# Altium project OSCILLAR_HFB_V1p0.PrjPcb
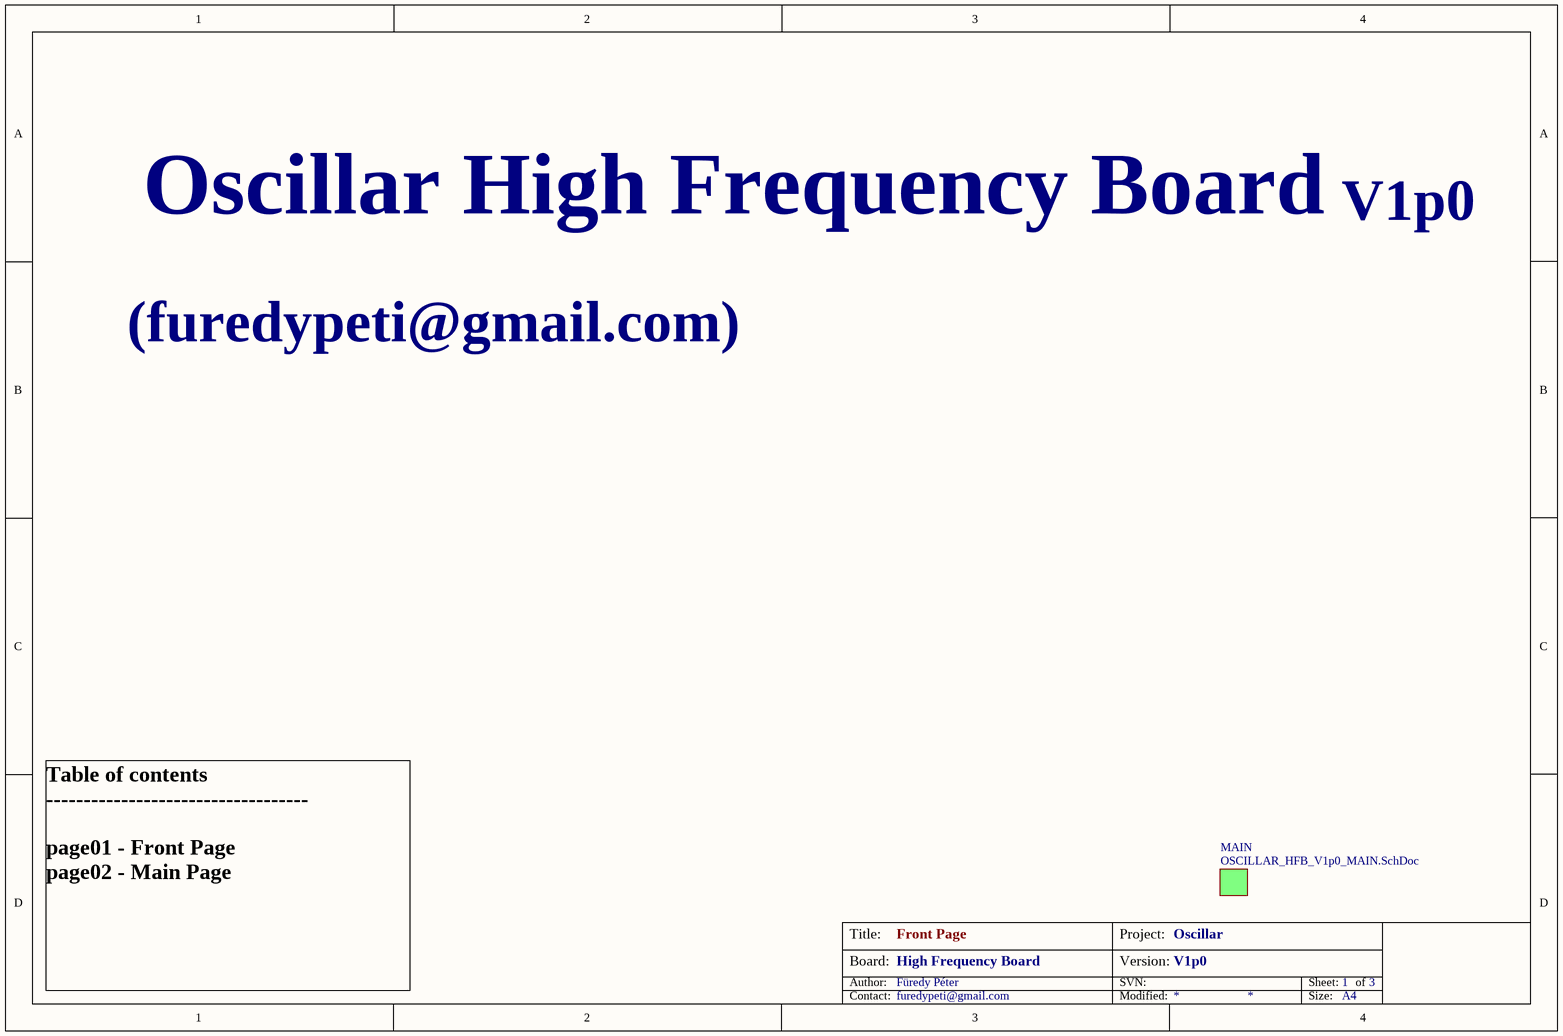
[diagram p0: OSCILLAR_HFB_V1p0_FRP.SchDoc]
GAuthor: Füredy Péter; GBoardName: High Frequency Board; GContact: furedypeti@gmail.com; GProjectName: Oscillar; GVersion: V1p0
13 sheets, 162 parts. Net scope: flat (ports and power ports of the same name join across sheets).
Board file: OSCILLAR_HFB_V1p0.PcbDoc
Sheets:
  OSCILLAR_HFB_V1p0_FRP.SchDoc
    MAIN = OSCILLAR_HFB_V1p0_MAIN.SchDoc
      MAIN SYNTH = OSCILLAR_HFB_V1p0_MSYN.SchDoc
      CAL = OSCILLAR_HFB_V1p0_CAL.SchDoc
      LVL = OSCILLAR_HFB_V1p0_LVL.SchDoc
      MECH = OSCILLAR_HFB_V1p0_MECH.SchDoc
      HFPS = OSCILLAR_HFB_V1p0_HFPS.SchDoc
      HFPS = OSCILLAR_HFB_V1p0_HFPS.SchDoc
      HFLNAMP = OSCILLAR_HFB_V1p0_HFLNAMP.SchDoc
      LFLNAMP = OSCILLAR_HFB_V1p0_LFLNAMP.SchDoc
      HFFILTB = OSCILLAR_HFB_V1p0_HFFILTB.SchDoc
      LFFILTB = OSCILLAR_HFB_V1p0_LFFILTB.SchDoc
      DRV = OSCILLAR_HFB_V1p0_DRV.SchDoc
  OSCILLAR_HFB_V1p0_INT.SchDoc

## Sheet OSCILLAR_HFB_V1p0_FRP.SchDoc
size A4; DocumentNumber: 1; SheetNumber: 1; SheetTotal: 3; Title_: Front Page

### Sub-sheets
MAIN = OSCILLAR_HFB_V1p0_MAIN.SchDoc: no entries

### Notes on the sheet
- (furedypeti@gmail.com)
- Table of contents
  -----------------------------------
  page01 - Front Page
  page02 - Main Page
- Board:
- Author:
- Title:
- Project:
- SVN:
- Version:
- Sheet:
- of
- Contact:
- Modified:
- Size:
- A4

## Sheet OSCILLAR_HFB_V1p0_MAIN.SchDoc
size A4; SheetNumber: 2; SheetTotal: 13; Title_: Main Page
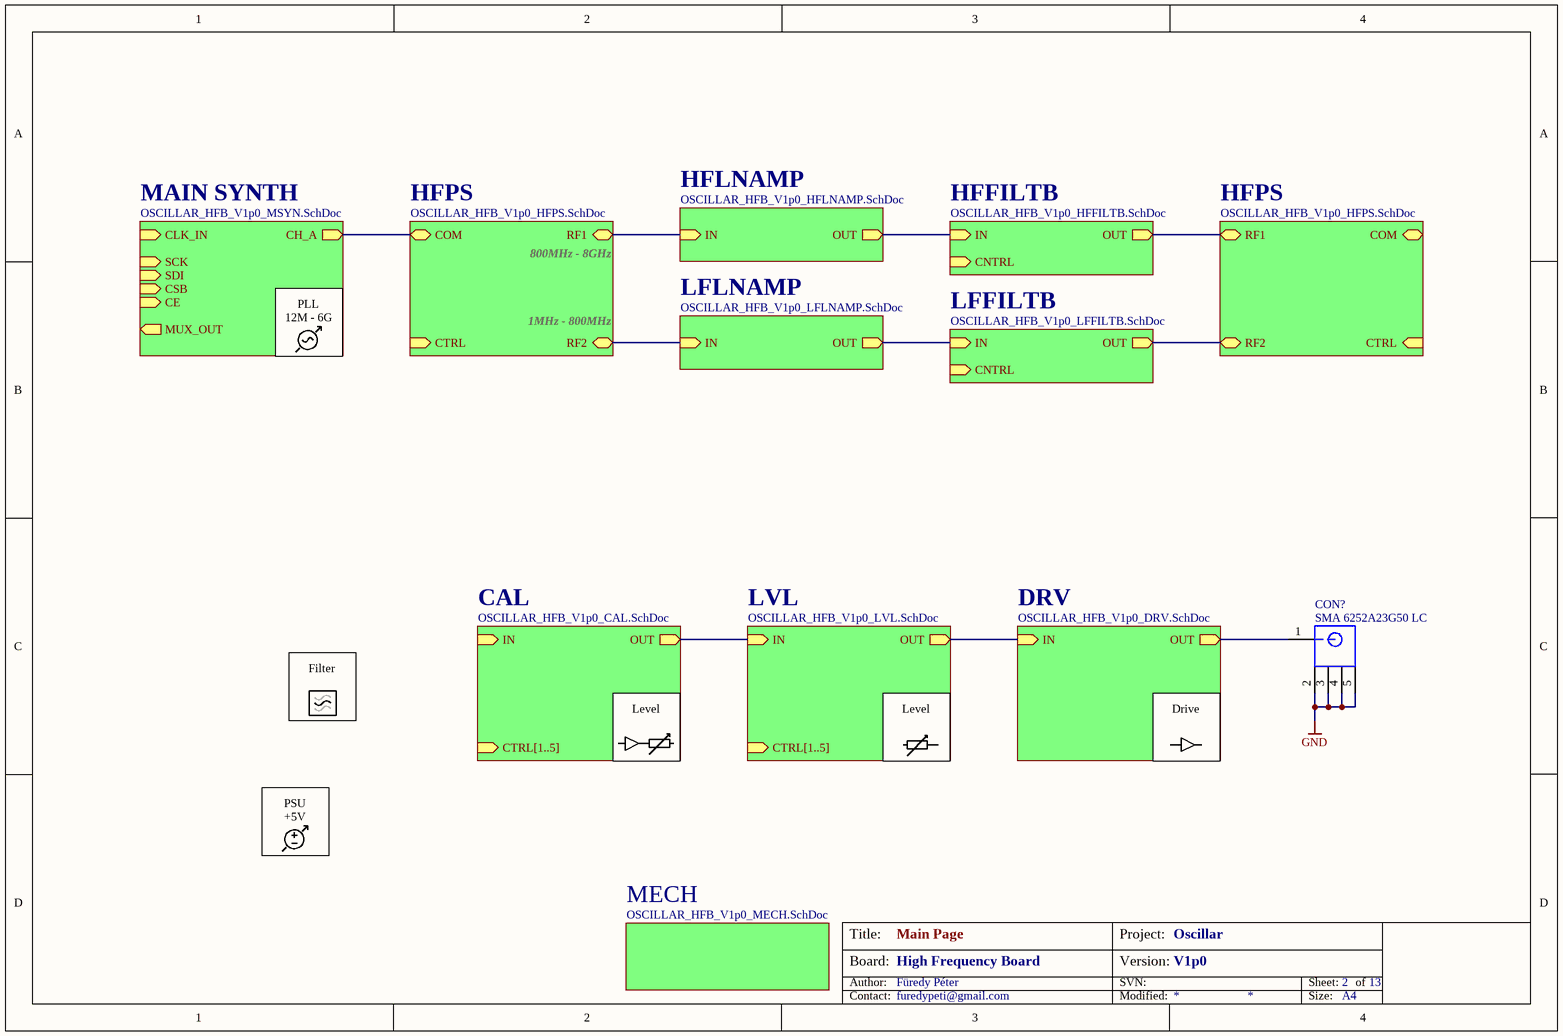
[diagram p1: OSCILLAR_HFB_V1p0_MAIN.SchDoc]

### Parts
(Parts that share a designator on the sheet are numbered #1, #2 ... from top to bottom, then left to right.)
CON?#1  SMA 6252A23G50 LC  [SMA-90]

### Sub-sheets
CAL = OSCILLAR_HFB_V1p0_CAL.SchDoc: IN (in), OUT (out), CTRL[1..5] (in)
DRV = OSCILLAR_HFB_V1p0_DRV.SchDoc: IN (in), OUT (out)
HFFILTB = OSCILLAR_HFB_V1p0_HFFILTB.SchDoc: IN (in), OUT (out), CNTRL (in)
HFLNAMP = OSCILLAR_HFB_V1p0_HFLNAMP.SchDoc: OUT (out), IN (in)
HFPS = OSCILLAR_HFB_V1p0_HFPS.SchDoc: COM (bidir), RF1 (bidir), CTRL (in), RF2 (bidir)
HFPS = OSCILLAR_HFB_V1p0_HFPS.SchDoc: RF1 (bidir), COM (bidir), CTRL (in), RF2 (bidir)
LFFILTB = OSCILLAR_HFB_V1p0_LFFILTB.SchDoc: IN (in), OUT (out), CNTRL (in)
LFLNAMP = OSCILLAR_HFB_V1p0_LFLNAMP.SchDoc: IN (in), OUT (out)
LVL = OSCILLAR_HFB_V1p0_LVL.SchDoc: IN (in), OUT (out), CTRL[1..5] (in)
MAIN SYNTH = OSCILLAR_HFB_V1p0_MSYN.SchDoc: CLK_IN (in), SCK (in), SDI (in), CSB (in), CE (in), MUX_OUT (out), CH_A (out)
MECH = OSCILLAR_HFB_V1p0_MECH.SchDoc: no entries

### Nets
GND: CON?#1.2 CON?#1.3 CON?#1.4 CON?#1.5
NetCON?#1_1: CON?#1.1 ; sheet DRV/OUT
(unnamed): sheet MAIN SYNTH/CH_A, sheet HFPS/COM
(unnamed): sheet CAL/OUT, sheet LVL/IN
(unnamed): sheet LVL/OUT, sheet DRV/IN
(unnamed): sheet HFPS/RF1, sheet HFLNAMP/IN
(unnamed): sheet HFPS/RF2, sheet LFLNAMP/IN
(unnamed): sheet HFPS/RF1, sheet HFFILTB/OUT
(unnamed): sheet HFPS/RF2, sheet LFFILTB/OUT
(unnamed): sheet HFLNAMP/OUT, sheet HFFILTB/IN
(unnamed): sheet LFLNAMP/OUT, sheet LFFILTB/IN

### Notes on the sheet
- 800MHz - 8GHz
- PLL
  12M - 6G
- 1MHz - 800MHz
- Filter
- Level
- Drive
- PSU
  +5V
- Board:
- Author:
- Title:
- Project:
- SVN:
- Version:
- Sheet:
- of
- Contact:
- Modified:
- Size:
- A4

### Library data of the parts
CON?#1 = SMA 6252A23G50 LC: SMA female, 90°; Part number: 100.310.40; Type: CON; Supplier: Hestore; ComponentLink1Description: Datasheet; ComponentLink2Description: Order; ComponentLink2URL: https://www.hestore.hu/prod_10031040.html

## Sheet OSCILLAR_HFB_V1p0_MSYN.SchDoc
size A4; SheetNumber: 3; SheetTotal: 11
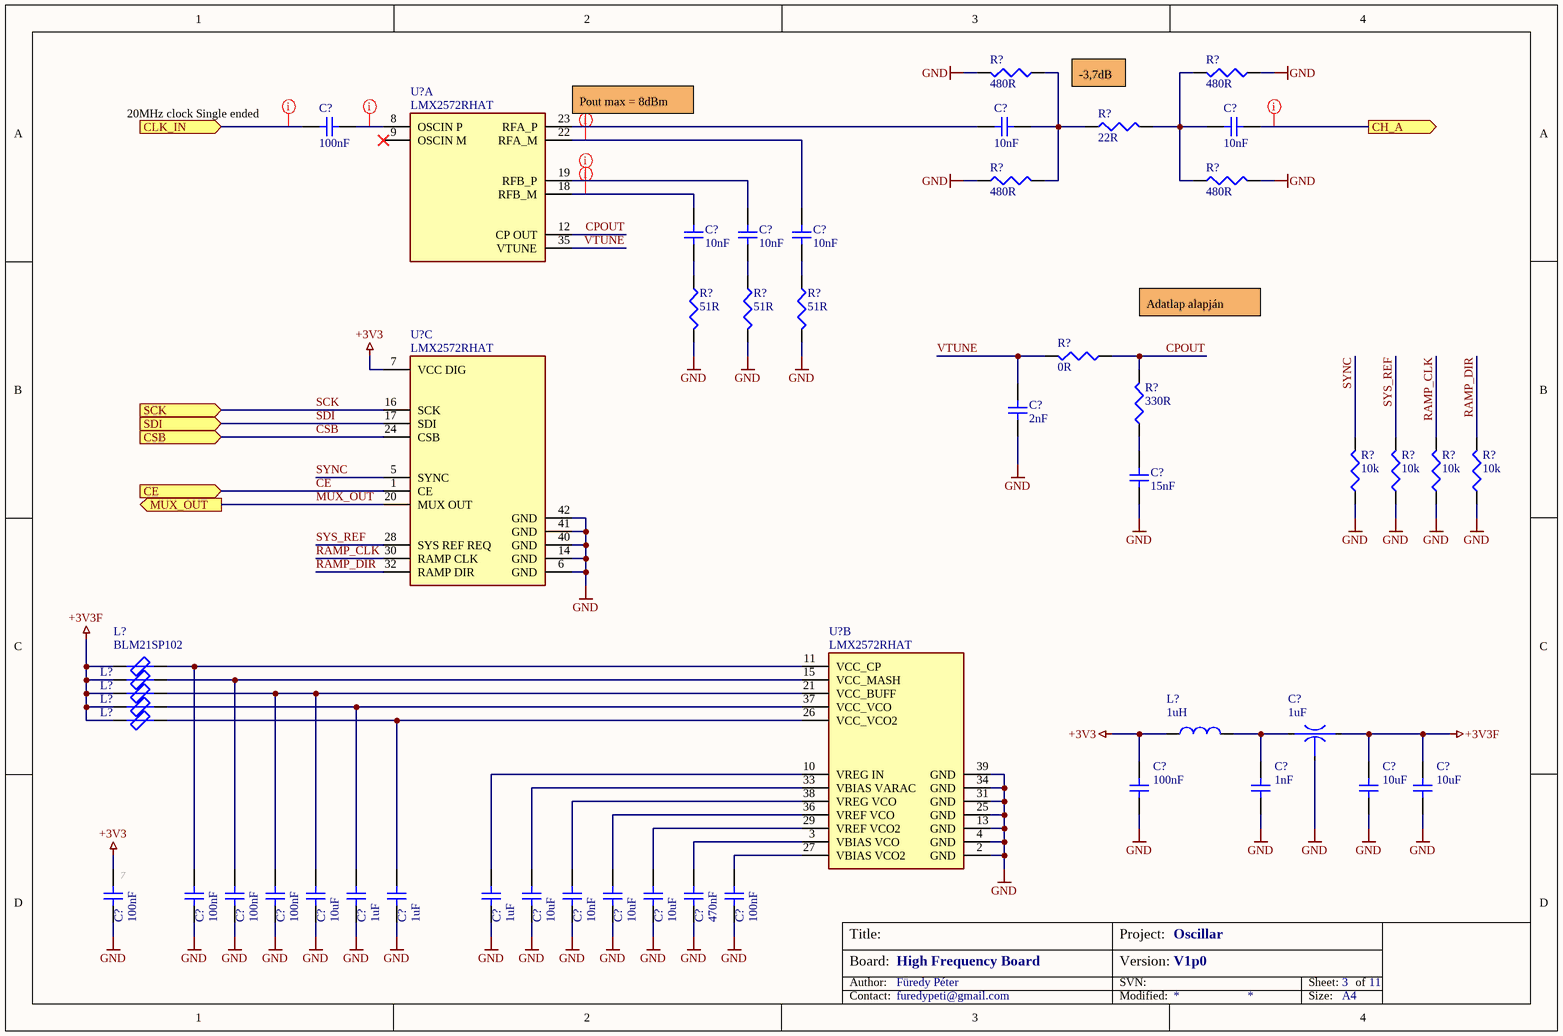
[diagram p2: OSCILLAR_HFB_V1p0_MSYN.SchDoc]

### Parts
(Parts that share a designator on the sheet are numbered #1, #2 ... from top to bottom, then left to right.)
C?#1  100nF  [CAP_0603]
C?#2  10nF  [CAP_0603]
C?#3  10nF  [CAP_0603]
C?#4  10nF  [CAP_0603]
C?#5  10nF  [CAP_0603]
C?#6  10nF  [CAP_0603]
C?#7  2nF  [CAP_0603]
C?#8  15nF  [CAP_0603]
C?#9  1uF  [CAP-0805-EMI]
C?#10  100nF  [CAP-0805]
C?#11  1nF  [CAP-0805]
C?#12  10uF  [CAP_0603]
C?#13  10uF  [CAP_0603]
C?#14  100nF  [CAP_0603]
C?#15  100nF  [CAP_0603]
C?#16  100nF  [CAP_0603]
C?#17  100nF  [CAP_0603]
C?#18  10uF  [CAP_0603]
C?#19  1uF  [CAP_0603]
C?#20  1uF  [CAP_0603]
C?#21  1uF  [CAP_0603]
C?#22  10uF  [CAP_0603]
C?#23  10nF  [CAP_0603]
C?#24  10uF  [CAP_0603]
C?#25  10uF  [CAP_0603]
C?#26  470nF  [CAP_0603]
C?#27  100nF  [CAP_0603]
L?#1  BLM21SP102  [IND-0805-EMI]
L?#2  1000R  [IND-0805-EMI]  (value not drawn)
L?#3  1000R  [IND-0805-EMI]  (value not drawn)
L?#4  1000R  [IND-0805-EMI]  (value not drawn)
L?#5  1000R  [IND-0805-EMI]  (value not drawn)
L?#6  1uH  [IND-0805]
R?#1  480R  [RES-0603]
R?#2  480R  [RES-0603]
R?#3  22R  [RES-0603]
R?#4  480R  [RES-0603]
R?#5  480R  [RES-0603]
R?#6  51R  [RES-0603]
R?#7  51R  [RES-0603]
R?#8  51R  [RES-0603]
R?#9  0R  [RES-0603]
R?#10  330R  [RES-0603]
R?#11  10k  [RES-0603]
R?#12  10k  [RES-0603]
R?#13  10k  [RES-0603]
R?#14  10k  [RES-0603]
U?#1  LMX2572RHAT  [VQFN40]  (part A of 3)
U?#2  LMX2572RHAT  [VQFN40]  (part C of 3)
U?#3  LMX2572RHAT  [VQFN40]  (part B of 3)

### Ports
CE (in, see OSCILLAR_HFB_V1p0_MAIN), CH_A (out, see OSCILLAR_HFB_V1p0_MAIN), CLK_IN (in, see OSCILLAR_HFB_V1p0_MAIN), CSB (in, see OSCILLAR_HFB_V1p0_MAIN), MUX_OUT (out, see OSCILLAR_HFB_V1p0_MAIN), SCK (in, see OSCILLAR_HFB_V1p0_MAIN), SDI (in, see OSCILLAR_HFB_V1p0_MAIN)

### Nets
+3V3: C?#10.1 C?#14.2 L?#6.1 U?#2.7(VCC_DIG)
+3V3F: C?#9.1 C?#12.1 C?#13.1 L?#1.1 L?#2.1 L?#3.1 L?#4.1 L?#5.1
GND: C?#7.2 C?#8.1 C?#9.2 C?#10.2 C?#11.2 C?#12.2 C?#13.2 C?#14.1 C?#15.1 C?#16.1 C?#17.1 C?#18.2 C?#19.1 C?#20.1 C?#21.2 C?#22.2 C?#23.2 C?#24.2 C?#25.2 C?#26.2 C?#27.2 R?#1.2 R?#2.2 R?#4.1 R?#5.1 R?#6.2 R?#7.2 R?#8.2 R?#11.1 R?#12.1 R?#13.1 R?#14.1 U?#2.6(GND) U?#2.14(GND) U?#2.40(GND) U?#2.41(GND) U?#2.42(GND) U?#3.2(GND) U?#3.4(GND) U?#3.13(GND) U?#3.25(GND) U?#3.31(GND) U?#3.34(GND) U?#3.39(GND)
CE: U?#2.1(CE) ; port CE
CPOUT: R?#9.1 R?#10.2 U?#1.12(CP_OUT)
CSB: U?#2.24(CSB) ; port CSB
MUX_OUT: U?#2.20(MUX_OUT) ; port MUX_OUT
RAMP_CLK: R?#13.2 U?#2.30(RAMP_CLK)
RAMP_DIR: R?#14.2 U?#2.32(RAMP_DIR)
SCK: U?#2.16(SCK) ; port SCK
SDI: U?#2.17(SDI) ; port SDI
SYNC: R?#11.2 U?#2.5(SYNC)
SYS_REF: R?#12.2 U?#2.28(SYS_REF_REQ)
VTUNE: C?#7.1 R?#9.2 U?#1.35(VTUNE)
NetC?#1_1: C?#1.1 U?#1.8(OSCIN_P)
NetC?#1_2: C?#1.2 ; port CLK_IN
NetC?#2_1: C?#2.1 R?#1.1 R?#3.2 R?#4.2
NetC?#2_2: C?#2.2 U?#1.23(RFA_P)
NetC?#3_1: C?#3.1 R?#2.1 R?#3.1 R?#5.2
NetC?#3_2: C?#3.2 ; port CH_A
NetC?#4_1: C?#4.1 U?#1.18(RFB_M)
NetC?#4_2: C?#4.2 R?#6.1
NetC?#5_1: C?#5.1 U?#1.19(RFB_P)
NetC?#5_2: C?#5.2 R?#7.1
NetC?#6_1: C?#6.1 U?#1.22(RFA_M)
NetC?#6_2: C?#6.2 R?#8.1
NetC?#8_2: C?#8.2 R?#10.1
NetC?#9_3: C?#9.3 C?#11.1 L?#6.2
NetC?#15_2: C?#15.2 L?#1.2 U?#3.11(VCC_CP)
NetC?#16_2: C?#16.2 L?#2.2 U?#3.15(VCC_MASH)
NetC?#17_2: C?#17.2 C?#18.1 L?#3.2 U?#3.21(VCC_BUFF)
NetC?#19_2: C?#19.2 L?#4.2 U?#3.37(VCC_VCO)
NetC?#20_2: C?#20.2 L?#5.2 U?#3.26(VCC_VCO2)
NetC?#21_1: C?#21.1 U?#3.10(VREG_IN)
NetC?#22_1: C?#22.1 U?#3.33(VBIAS_VARAC)
NetC?#23_1: C?#23.1 U?#3.38(VREG_VCO)
NetC?#24_1: C?#24.1 U?#3.36(VREF_VCO)
NetC?#25_1: C?#25.1 U?#3.29(VREF_VCO2)
NetC?#26_1: C?#26.1 U?#3.3(VBIAS_VCO)
NetC?#27_1: C?#27.1 U?#3.27(VBIAS_VCO2)

Not connected (* = marked no-connect by the designer): U?#1 9(OSCIN_M)*

### Layout directives
net class 50R: NetC?#1_1, NetC?#1_2, NetC?#2_2, NetC?#3_2, NetC?#4_1, NetC?#5_1, NetC?#6_1

### Notes on the sheet
- (near C?#1) 20MHz clock Single ended
- (near U?#1) Pout max = 8dBm
- (near R?#1) -3,7dB
- Adatlap alapján
- (near C?#14) 7
- Board:
- Author:
- Title:
- Project:
- SVN:
- Version:
- Sheet:
- of
- Contact:
- Modified:
- Size:
- A4

### Library data of the parts
C?#1-C?#8 C?#10-C?#27 = NP-CAPACITOR: MLCC capacitor; Type: CAP
C?#9 = EMI_CAPACITOR: EMI filter capacitor; Type: CAP
L?#1-L?#5 = BLM21SP102SN1D: Chip Ferrite Bead, 1000R @100MHz, 1.6A; Part number: 81-BLM21SP102SN1D; Type: IND; Supplier: Mouser; ComponentLink1Description: Datasheet; ComponentLink1URL: ENFA0005-1915781.pdf; ComponentLink2Description: Order; ComponentLink2URL: https://hu.mouser.com/ProductDetail/Murata-Electronics/BLM21SP102SN1D?qs=17u8i%2FzlE88oj6hmj%252BXptA%3D%3D
L?#6 = AC-INDUCTOR: Air core coil; Type: IND
R?#1-R?#14 = RESISTOR: Metal Film Resistor; Type: RES
U?#1-U?#3 = LMX2572RHAT: Phase Locked Loop, PLL 6.4-GHz, low power, wideband RF synthesizer with FSK modulation; Part number: 595-LMX2572RHAT; Supplier: Mouser; Type: IC; ComponentLink1Description: Datasheet; ComponentLink1URL: lmx2572lp.pdf; ComponentLink2Description: Order; ComponentLink2URL: https://hu.mouser.com/ProductDetail/Texas-Instruments/LMX2572RHAT?qs=BZBei1rCqCAcV8D5kfnwXg%3D%3D

## Sheet OSCILLAR_HFB_V1p0_CAL.SchDoc
size A4; SheetNumber: 9; SheetTotal: 11; Title_: Aux Gain Stabilization Block
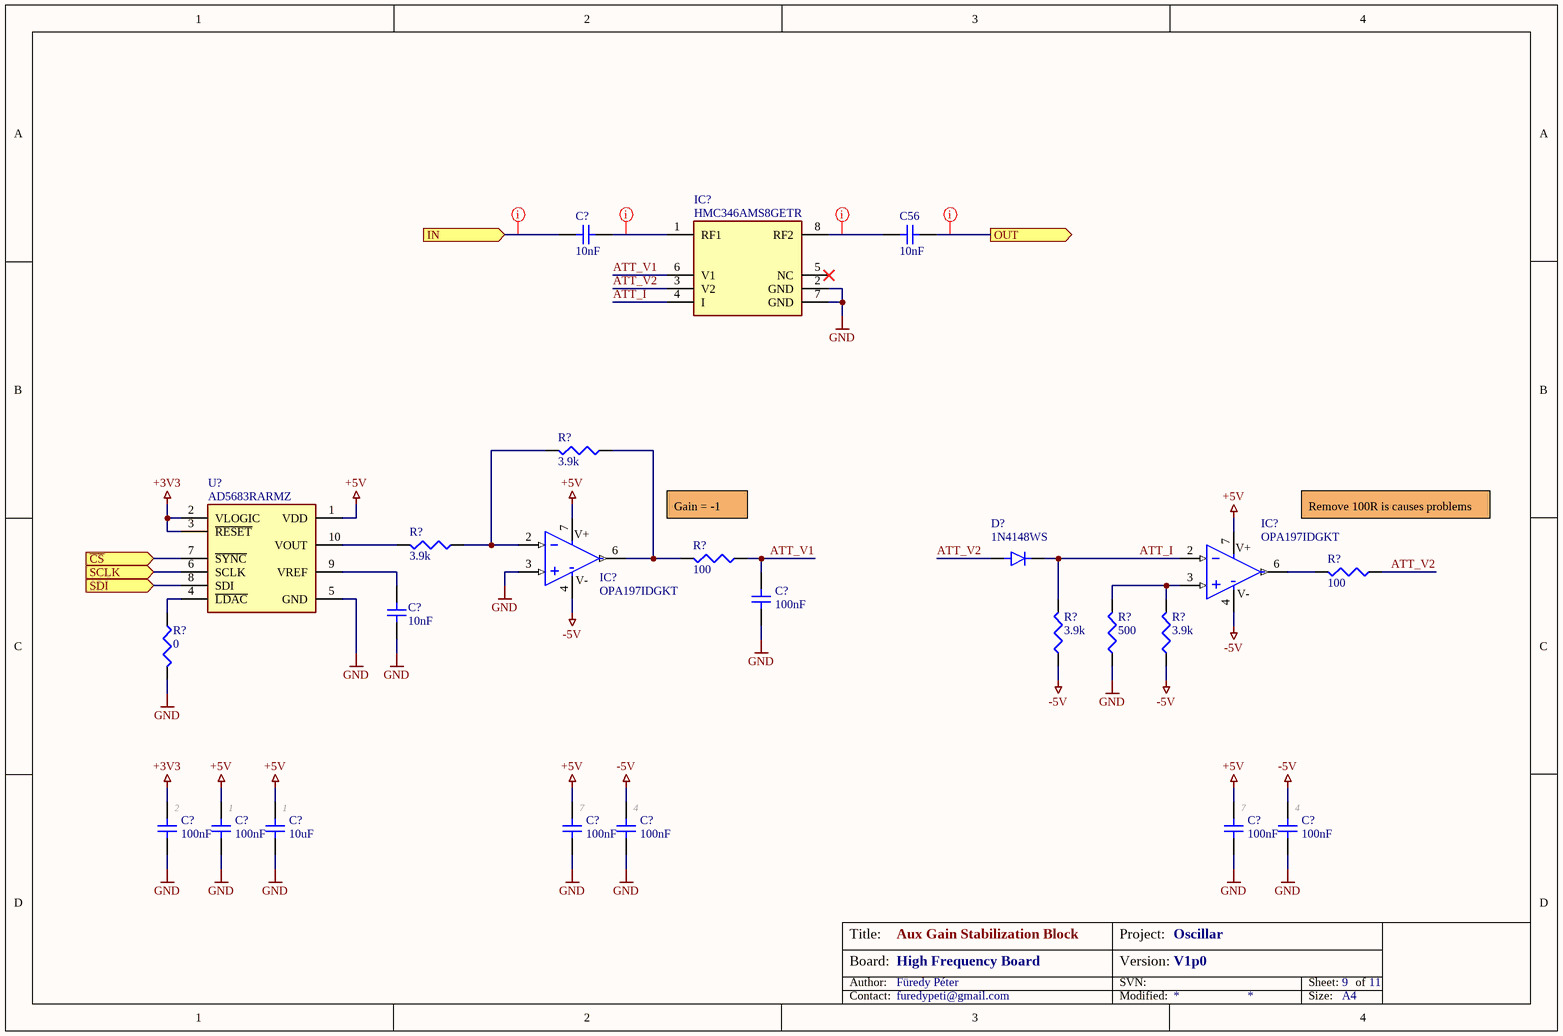
[diagram p3: OSCILLAR_HFB_V1p0_CAL.SchDoc]

### Parts
(Parts that share a designator on the sheet are numbered #1, #2 ... from top to bottom, then left to right.)
C56#1  10nF  [CAP_0603]
C?#28  10nF  [CAP_0603]
C?#29  100nF  [CAP-0805]
C?#30  10nF  [CAP_0603]
C?#31  100nF  [CAP-0805]
C?#32  100nF  [CAP-0805]
C?#33  10uF  [CAP_0603]
C?#34  100nF  [CAP-0805]
C?#35  100nF  [CAP-0805]
C?#36  100nF  [CAP-0805]
C?#37  100nF  [CAP-0805]
D?  1N4148WS  [SOD-323]
IC?#1  HMC346AMS8GETR  [MSOP-8_p0.65_EXP]
IC?#2  OPA197IDGKT  [VSSOP8]
IC?#3  OPA197IDGKT  [VSSOP8]
R?#15  3.9k  [RES-0603]
R?#16  3.9k  [RES-0603]
R?#17  100  [RES-0603]
R?#18  100  [RES-0603]
R?#19  3.9k  [RES-0603]
R?#20  500  [RES-0603]
R?#21  3.9k  [RES-0603]
R?#22  0  [RES-0603]
U?#4  AD5683RARMZ  [MSOP-10]

### Ports
IN (in, see OSCILLAR_HFB_V1p0_MAIN), OUT (out, see OSCILLAR_HFB_V1p0_MAIN), SCLK (in), SDI (in), ~{CS} (in)

### Nets
+3V3: C?#31.1 U?#4.2(VLOGIC) U?#4.3(~{RESET})
+5V: C?#32.1 C?#33.1 C?#34.1 C?#36.1 IC?#2.7(V+) IC?#3.7(V+) U?#4.1(VDD)
-5V: C?#35.1 C?#37.1 IC?#2.4(V-) IC?#3.4(V-) R?#19.2 R?#21.2
GND: C?#29.2 C?#30.2 C?#31.2 C?#32.2 C?#33.2 C?#34.2 C?#35.2 C?#36.2 C?#37.2 IC?#1.2(GND) IC?#1.7(GND) IC?#2.3 R?#20.2 R?#22.1 U?#4.5(GND)
ATT_I: D?.2 IC?#1.4(I) IC?#3.2 R?#19.1
ATT_V1: C?#29.1 IC?#1.6(V1) R?#17.2
ATT_V2: D?.1 IC?#1.3(V2) R?#18.2
SDI: U?#4.8(SDI) ; port SDI
NetC55#1_1: C56#1.1 ; port OUT
NetC56#1_2: C56#1.2 IC?#1.8(RF2)
NetC100#1_2: C?#28.2 ; port IN
NetC?#28_1: C?#28.1 IC?#1.1(RF1)
NetC?#30_1: C?#30.1 U?#4.9(VREF)
NetIC?#2_2: IC?#2.2 R?#15.1 R?#16.2
NetIC?#2_6: IC?#2.6(OUT) R?#15.2 R?#17.1
NetIC?#3_3: IC?#3.3 R?#20.1 R?#21.1
NetIC?#3_6: IC?#3.6(OUT) R?#18.1
NetR?#16_1: R?#16.1 U?#4.10(VOUT)
NetR?#22_2: R?#22.2 U?#4.4(~{LDAC})
NetU?#4_6: U?#4.6(SCLK) ; port SCLK
NetU?#4_7: U?#4.7(~{SYNC}) ; port ~{CS}

Not connected (* = marked no-connect by the designer): IC?#1 5(NC)*

### Layout directives
net class 50R: NetC55#1_1, NetC56#1_2, NetC100#1_2, NetC?#28_1

### Notes on the sheet
- (near R?#17) Gain = -1
- Remove 100R is causes problems
- (near C?#31) 2
- (near C?#32) 1
- (near C?#33) 1
- (near C?#34) 7
- (near C?#35) 4
- (near C?#36) 7
- (near C?#37) 4
- Board:
- Author:
- Title:
- Project:
- SVN:
- Version:
- Sheet:
- of
- Contact:
- Modified:
- Size:
- A4

### Library data of the parts
C56#1 C?#28-C?#37 = NP-CAPACITOR: MLCC capacitor; Type: CAP
D? = 1N4148WS: Small Signal Diode, 75V, 150mA; Part number: 2453269; ComponentLink1Description: Datasheet; ComponentLink1URL: ONSM-S-A0013042080-1.pdf; Supplier: Farnell; ComponentLink2Description: Order; ComponentLink2URL: https://hu.farnell.com/on-semiconductor/1n4148ws/diode-small-signal-75v-sod-323f/dp/2453269?ost=2453269; Type: Diode
IC?#1 = HMC346AMS8GETR: Attenuators DC to 8 GHz, Analog voltage variable, GaAs MMIC; Part number: 584-HMC346AMS8GETR; Type: IC; Supplier: Mouser; ComponentLink1Description: Datasheet; ComponentLink1URL: hmc470A-3123262.pdf; ComponentLink2Description: Order; ComponentLink2URL: https://hu.mouser.com/ProductDetail/Analog-Devices/HMC346AMS8GETR?qs=5aG0NVq1C4wB%2Fd11tx7%252Bpw%3D%3D
IC?#2 IC?#3 = OPA197IDGKT: Precision Amplifier, 36-V, Rail-to-Rail; Part number: 595-OPA197IDGKT; Supplier: Mouser; Type: OPAMP; ComponentLink1Description: Datasheet; ComponentLink1URL: opa197.pdf; ComponentLink2Description: Order; ComponentLink2URL: https://hu.mouser.com/ProductDetail/Texas-Instruments/OPA197IDGKT?qs=sGAEpiMZZMutXGli8Ay4kO%252BXbIT%252B3d3SHv8SiZ1MpK0%3D
R?#15-R?#22 = RESISTOR: Metal Film Resistor; Type: RES
U?#4 = AD5683RARMZ: Digital to Analogue Converter, 16 bit, 3 Wire, SPI, 2.7V to 5.5V, A grade; Part number: 4017562; Supplier: Farnell; Type: IC; ComponentLink1Description: Datasheet; ComponentLink1URL: AD5683R_5682R_5681R_5683.pdf; ComponentLink2Description: Order; ComponentLink2URL: https://hu.farnell.com/analog-devices/ad5683rarmz/dac-16bit-msop-10-40-to-105deg/dp/4017562?st=ad5683r

## Sheet OSCILLAR_HFB_V1p0_LVL.SchDoc
size A4; SheetNumber: 10; SheetTotal: 13; Title_: Aux Gain Stabilization Block
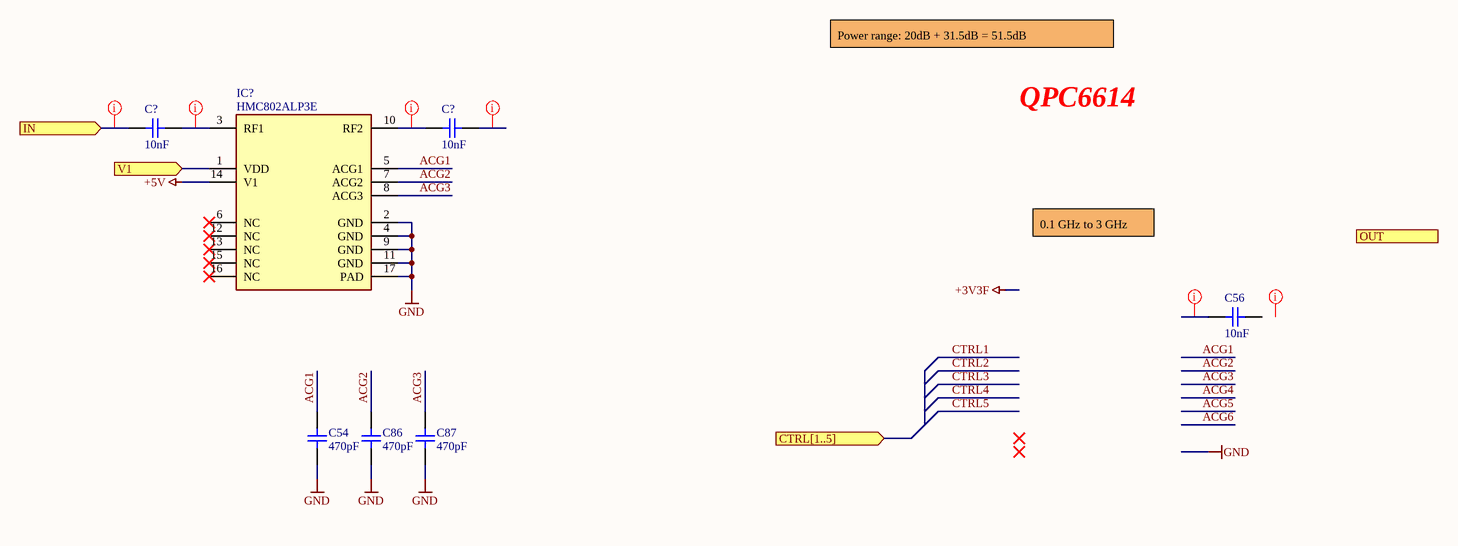
[diagram p4: OSCILLAR_HFB_V1p0_LVL.SchDoc]

### Parts
(Parts that share a designator on the sheet are numbered #1, #2 ... from top to bottom, then left to right.)
C54  470pF  [CAP_0603]
C56#2  10nF  [CAP_0603]
C86  470pF  [CAP_0603]
C87  470pF  [CAP_0603]
C?#38  10nF  [CAP_0603]
C?#39  10nF  [CAP_0603]
IC?#4  HMC802ALP3E  [QFN-16]

### Ports
CTRL[1..5] (in, see OSCILLAR_HFB_V1p0_MAIN), IN (in, see OSCILLAR_HFB_V1p0_MAIN), OUT (out, see OSCILLAR_HFB_V1p0_MAIN), V1 (in)

### Nets
+5V: IC?#4.14(V1)
GND: C54.2 C86.2 C87.2 IC?#4.2(GND) IC?#4.4(GND) IC?#4.9(GND) IC?#4.11(GND) IC?#4.17(PAD)
ACG1: C54.1 IC?#4.5(ACG1)
ACG2: C86.1 IC?#4.7(ACG2)
ACG3: C87.1 IC?#4.8(ACG3)
V1: IC?#4.1(VDD) ; port V1
NetC100#1_2: C?#38.2 ; port IN
NetC?#38_1: C?#38.1 IC?#4.3(RF1)
NetC?#39_2: C?#39.2 IC?#4.10(RF2)

Not connected (* = marked no-connect by the designer): C56#2 1 2; C?#39 1; IC?#4 6(NC)* 12(NC)* 13(NC)* 15(NC)* 16(NC)*

### Layout directives
net class 50R: (no net found under the mark), NetC56#2_2, NetC100#1_2, NetC?#38_1, NetC?#39_1, NetC?#39_2

### Notes on the sheet
- Power range: 20dB + 31.5dB = 51.5dB
- QPC6614
- 0.1 GHz to 3 GHz
- Board:
- Author:
- Title:
- Project:
- SVN:
- Version:
- Sheet:
- of
- Contact:
- Modified:
- Size:
- A4

### Library data of the parts
C54 C56#2 C86 C87 C?#38 C?#39 = NP-CAPACITOR: MLCC capacitor; Type: CAP
IC?#4 = HMC802ALP3E: Attenuator, DC-6000MHz DATT 1 bit 20dB; Part number: 584-HMC802ALP3E; Supplier: Mouser; Type: IC; ComponentLink1Description: Datasheet; ComponentLink2Description: Order; ComponentLink2URL: https://hu.mouser.com/ProductDetail/Analog-Devices/HMC802ALP3E?qs=JeIcUl65ClAAleVEB%252BGkCg%3D%3D

## Sheet OSCILLAR_HFB_V1p0_MECH.SchDoc
size A4; SheetNumber: 7; SheetTotal: 8
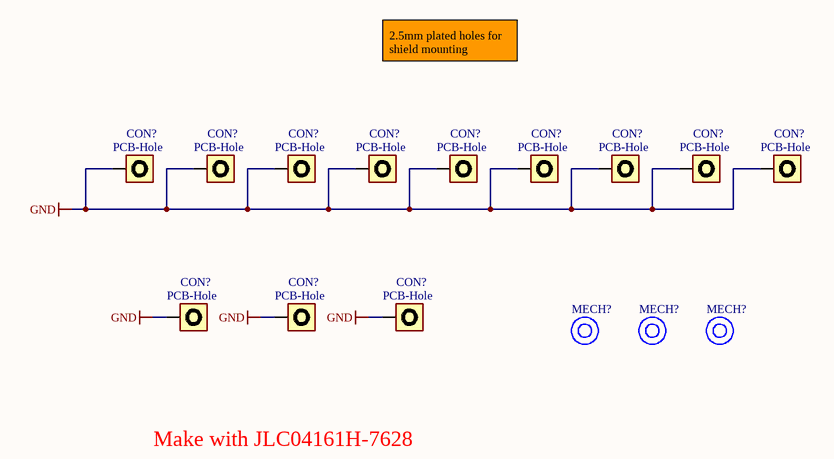
[diagram p5: OSCILLAR_HFB_V1p0_MECH.SchDoc]

### Parts
(Parts that share a designator on the sheet are numbered #1, #2 ... from top to bottom, then left to right.)
CON?#2  PCB-Hole  [M2.5_PAD2]
CON?#3  PCB-Hole  [M2.5_PAD2]
CON?#4  PCB-Hole  [M2.5_PAD2]
CON?#5  PCB-Hole  [M2.5_PAD2]
CON?#6  PCB-Hole  [M2.5_PAD2]
CON?#7  PCB-Hole  [M2.5_PAD2]
CON?#8  PCB-Hole  [M2.5_PAD2]
CON?#9  PCB-Hole  [M2.5_PAD2]
CON?#10  PCB-Hole  [M2.5_PAD2]
CON?#11  PCB-Hole  [M2.5_PAD2]  (no BOM)
CON?#12  PCB-Hole  [M2.5_PAD2]  (no BOM)
CON?#13  PCB-Hole  [M2.5_PAD2]  (no BOM)
MECH?#1  Fiducial  [FIDU_1MM]  (value not drawn)  (no BOM)
MECH?#2  Fiducial  [FIDU_1MM]  (value not drawn)  (no BOM)
MECH?#3  Fiducial  [FIDU_1MM]  (value not drawn)  (no BOM)

### Nets
GND: CON?#2.1 CON?#3.1 CON?#4.1 CON?#5.1 CON?#6.1 CON?#7.1 CON?#8.1 CON?#9.1 CON?#10.1 CON?#11.1 CON?#12.1 CON?#13.1

### Notes on the sheet
- 2.5mm plated holes for shield mounting
- Make with JLC04161H-7628
- Board:
- Author:
- Title:
- Project:
- SVN:
- Version:
- Sheet:
- of
- Contact:
- Modified:
- Size:
- A4

### Library data of the parts
CON?#2-CON?#13 = PCB-Hole: PCB hole
MECH?#1-MECH?#3 = FIDU: Fiducatial, round, 1mm

## Sheet OSCILLAR_HFB_V1p0_HFPS.SchDoc
size A4; SheetNumber: 4; SheetTotal: 11; Title_: Low Frequency Path Switch
Used 2 times, as channels MAIN/HFPS, MAIN/HFPS. Parts and nets are listed once, with the designators drawn on the sheet.
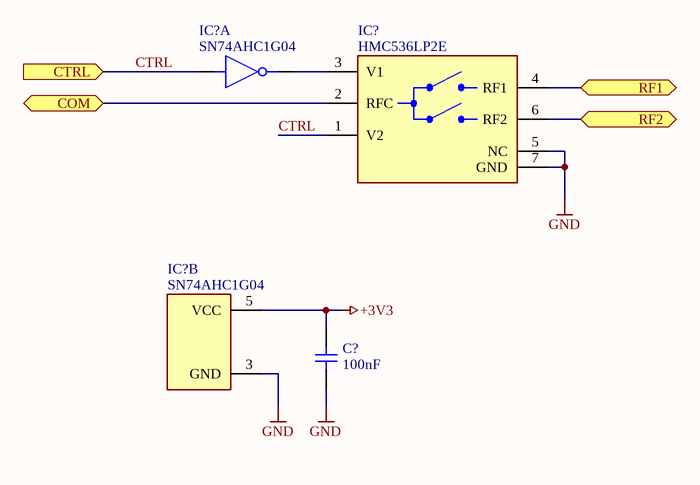
[diagram p6: OSCILLAR_HFB_V1p0_HFPS.SchDoc]

### Parts
(Parts that share a designator on the sheet are numbered #1, #2 ... from top to bottom, then left to right.)
C?  100nF  [CAP_0603]
IC?#1  SN74AHC1G04  [SC-70-5]  (part A of 2)
IC?#2  HMC536LP2E  [DFN-6]
IC?#3  SN74AHC1G04  [SC-70-5]  (part B of 2)

### Ports
COM (bidir, see OSCILLAR_HFB_V1p0_MAIN), CTRL (in, see OSCILLAR_HFB_V1p0_MAIN), RF1 (bidir, see OSCILLAR_HFB_V1p0_MAIN), RF2 (bidir, see OSCILLAR_HFB_V1p0_MAIN)

### Nets
+3V3: C?.2 IC?#3.5(VCC)
GND: C?.1 IC?#2.5(NC) IC?#2.7(GND) IC?#3.3(GND)
COM: IC?#2.2(RFC) ; port COM
CTRL: IC?#1.2(A) IC?#2.1(V2) ; port CTRL
RF1: IC?#2.4(RF1) ; port RF1
RF2: IC?#2.6(RF2) ; port RF2
NetIC?#1_4: IC?#1.4(Y) IC?#2.3(V1)

### Channels
MAIN/HFPS: designators C?=C?_MAIN_HFPS#1 IC?=IC?_MAIN_HFPS#2 IC?=IC?_MAIN_HFPS#1 IC?=IC?_MAIN_HFPS#3; ports COM=NetIC?_MAIN_HFPS#2_2 CTRL=CTRL RF1=NetIC?_MAIN_HFPS#2_4 RF2=NetIC?_MAIN_HFPS#2_6
MAIN/HFPS: designators C?=C?_MAIN_HFPS#2 IC?=IC?_MAIN_HFPS#5 IC?=IC?_MAIN_HFPS#4 IC?=IC?_MAIN_HFPS#6; ports COM=NetIC?_MAIN_HFPS#2_2 CTRL=CTRL RF1=NetIC?_MAIN_HFPS#2_4 RF2=NetIC?_MAIN_HFPS#2_6

### Notes on the sheet
- Board:
- Author:
- Title:
- Project:
- SVN:
- Version:
- Sheet:
- of
- Contact:
- Modified:
- Size:
- A4

### Library data of the parts
C? = NP-CAPACITOR: MLCC capacitor; Type: CAP
IC?#1 IC?#3 = SN74AHC1G04: Signle inverter, 2V-5V; Part number: 595-SN74AHC1G04DCKT; Supplier: Mouser; Type: IC; ComponentLink1Description: Datasheet; ComponentLink2Description: Order; ComponentLink2URL: https://hu.mouser.com/ProductDetail/Texas-Instruments/SN74AHC1G04DCKT?qs=pdM4geFiyZTdyzHE1xB18A%3D%3D
IC?#2 = HMC536LP2E: RF Switch, SPDT, DC-6GHz; Part number: 584-HMC536LP2E; Supplier: Mouser; Type: IC; ComponentLink1Description: Datasheet; ComponentLink2Description: Order; ComponentLink2URL: https://hu.mouser.com/ProductDetail/Analog-Devices/HMC536LP2E?qs=3izLlwrMQ7kxqt%252Bzr3QT4g%3D%3D

## Sheet OSCILLAR_HFB_V1p0_HFLNAMP.SchDoc
size A4; SheetNumber: 5; SheetTotal: 11; Title_: High Freq. Low Noise Amp.
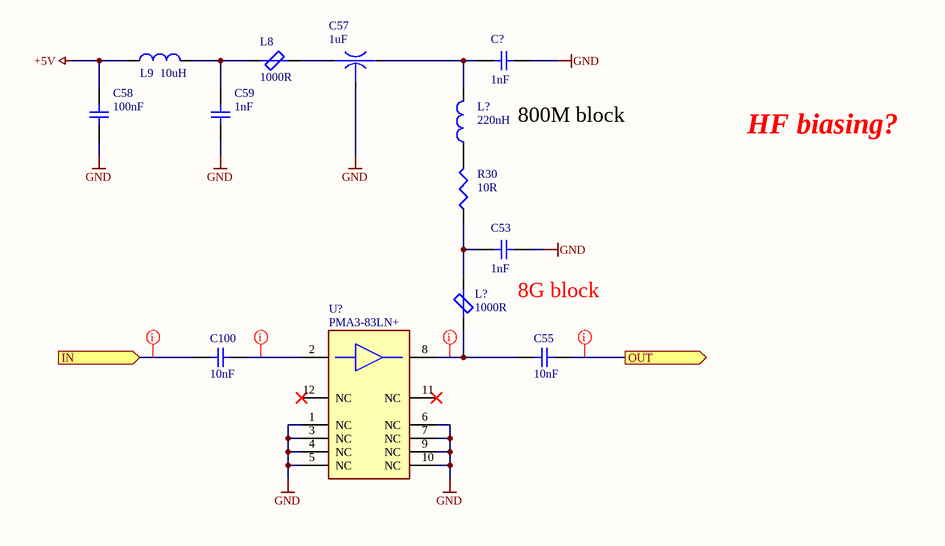
[diagram p7: OSCILLAR_HFB_V1p0_HFLNAMP.SchDoc]

### Parts
(Parts that share a designator on the sheet are numbered #1, #2 ... from top to bottom, then left to right.)
C53#1  1nF  [CAP-0805]
C55#1  10nF  [CAP_0603]
C57#1  1uF  [CAP-0805-EMI]
C58#1  100nF  [CAP-0805]
C59#1  1nF  [CAP-0805]
C100#1  10nF  [CAP_0603]
C?#40  1nF  [CAP-0805]
L8#1  1000R  [IND-0805-EMI]
L9#1  10uH  [IND-0805-EMI]
L?#7  220nH  [IND-0805]
L?#8  1000R  [IND-0805-EMI]
R30#1  10R  [RES-0805]
U?#5  PMA3-83LN+  [DQ1225]

### Ports
IN (in, see OSCILLAR_HFB_V1p0_MAIN), OUT (out, see OSCILLAR_HFB_V1p0_MAIN)

### Nets
+5V: C58#1.1 L9#1.1
GND: C53#1.2 C57#1.2 C58#1.2 C59#1.2 C?#40.2 U?#5.1(NC) U?#5.3(NC) U?#5.4(NC) U?#5.5(NC) U?#5.6(NC) U?#5.7(NC) U?#5.9(NC) U?#5.10(NC)
NetC53#1_1: C53#1.1 L?#8.2 R30#1.1
NetC55#1_1: C55#1.1 ; port OUT
NetC55#1_2: C55#1.2 L?#8.1 U?#5.8(RF_OUT)
NetC57#1_1: C57#1.1 C?#40.1 L?#7.2
NetC57#1_3: C57#1.3 L8#1.2
NetC59#1_1: C59#1.1 L8#1.1 L9#1.2
NetC100#1_1: C100#1.1 U?#5.2(RF_IN)
NetC100#1_2: C100#1.2 ; port IN
NetL?#7_1: L?#7.1 R30#1.2

Not connected (* = marked no-connect by the designer): U?#5 11(NC)* 12(NC)*

### Layout directives
net class 50R: NetC55#1_1, NetC55#1_2, NetC100#1_1, NetC100#1_2

### Notes on the sheet
- 800M block
- HF biasing?
- (near C53#1) 8G block
- Board:
- Author:
- Title:
- Project:
- SVN:
- Version:
- Sheet:
- of
- Contact:
- Modified:
- Size:
- A4

### Library data of the parts
C53#1 C55#1 C58#1 C59#1 C100#1 C?#40 = NP-CAPACITOR: MLCC capacitor; Type: CAP
C57#1 = EMI_CAPACITOR: EMI filter capacitor; Type: CAP
L8#1 L?#8 = BLM21SP102SN1D: as L?#1 on sheet OSCILLAR_HFB_V1p0_MSYN; Supplier: Mouser; ComponentLink1Description: Datasheet; ComponentLink1URL: ENFA0005-1915781.pdf; ComponentLink2Description: Order; ComponentLink2URL: https://hu.mouser.com/ProductDetail/Murata-Electronics/BLM21SP102SN1D?qs=17u8i%2FzlE88oj6hmj%252BXptA%3D%3D
L9#1 L?#7 = AC-INDUCTOR: Air core coil; Type: IND
R30#1 = RESISTOR: Metal Film Resistor; Type: RES
U?#5 = PMA3-83LN+: RF Amplifier, Low noise, 500M-8GHz, +5V, +21dB; Part number: 139-PMA3-83LN; ComponentLink1Description: Datasheet; Supplier: Mouser; ComponentLink2Description: Order; ComponentLink2URL: https://hu.mouser.com/ProductDetail/Mini-Circuits/PMA3-83LN%2b?qs=xZ%2FP%252Ba9zWqbScBj7fhbP6Q%3D%3D; Type: IC

## Sheet OSCILLAR_HFB_V1p0_LFLNAMP.SchDoc
size A4; SheetNumber: 6; SheetTotal: 12; Title_: Low Freq. Low Noise Amp.
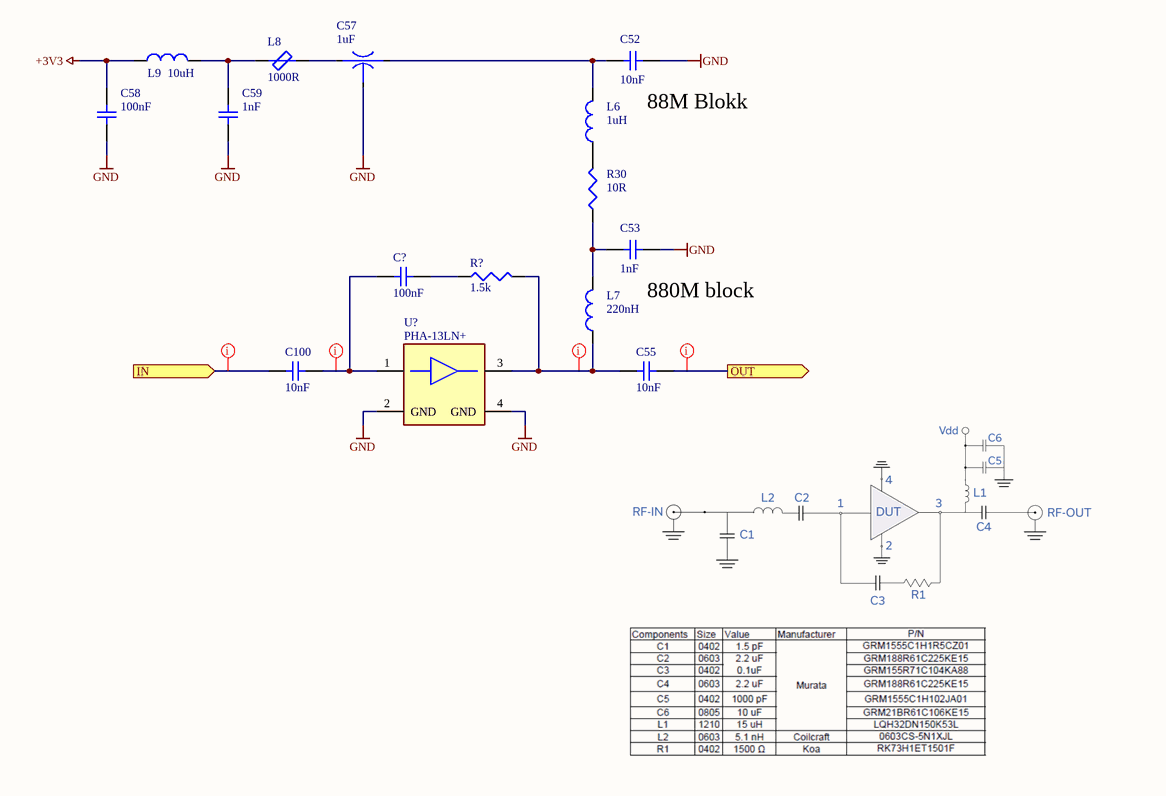
[diagram p8: OSCILLAR_HFB_V1p0_LFLNAMP.SchDoc]

### Parts
(Parts that share a designator on the sheet are numbered #1, #2 ... from top to bottom, then left to right.)
C52#1  10nF  [CAP-0805]
C53#2  1nF  [CAP-0805]
C55#2  10nF  [CAP_0603]
C57#2  1uF  [CAP-0805-EMI]
C58#2  100nF  [CAP-0805]
C59#2  1nF  [CAP-0805]
C100#2  10nF  [CAP_0603]
C?#41  100nF  [CAP_0603]
L6#1  1uH  [IND-0805]
L7#1  220nH  [IND-0805]
L8#2  1000R  [IND-0805-EMI]
L9#2  10uH  [IND-0805-EMI]
R30#2  10R  [RES-0805]
R?#23  1.5k  [RES-0603]
U?#6  PHA-13LN+  [DF782]

### Ports
IN (in, see OSCILLAR_HFB_V1p0_MAIN), OUT (out, see OSCILLAR_HFB_V1p0_MAIN)

### Nets
+3V3: C58#2.1 L9#2.1
GND: C52#1.2 C53#2.2 C57#2.2 C58#2.2 C59#2.2 U?#6.2(GND) U?#6.4(GND)
NetC52#1_1: C52#1.1 C57#2.1 L6#1.2
NetC53#2_1: C53#2.1 L7#1.2 R30#2.1
NetC55#1_1: C55#2.1 ; port OUT
NetC55#2_2: C55#2.2 L7#1.1 R?#23.2 U?#6.3(RF_OUT)
NetC57#2_3: C57#2.3 L8#2.2
NetC59#2_1: C59#2.1 L8#2.1 L9#2.2
NetC100#1_2: C100#2.2 ; port IN
NetC100#2_1: C100#2.1 C?#41.2 U?#6.1(RF_IN)
NetC?#41_1: C?#41.1 R?#23.1
NetL6#1_1: L6#1.1 R30#2.2

### Layout directives
net class 50R: NetC55#1_1, NetC55#2_2, NetC100#1_2, NetC100#2_1

### Notes on the sheet
- (near C52#1) 88M Blokk
- (near C53#2) 880M block
- Board:
- Author:
- Title:
- Project:
- SVN:
- Version:
- Sheet:
- of
- Contact:
- Modified:
- Size:
- A4

### Library data of the parts
C52#1 C53#2 C55#2 C58#2 C59#2 C100#2 C?#41 = NP-CAPACITOR: MLCC capacitor; Type: CAP
C57#2 = EMI_CAPACITOR: EMI filter capacitor; Type: CAP
L6#1 L7#1 L9#2 = AC-INDUCTOR: Air core coil; Type: IND
L8#2 = BLM21SP102SN1D: as L?#1 on sheet OSCILLAR_HFB_V1p0_MSYN; Supplier: Mouser; ComponentLink1Description: Datasheet; ComponentLink1URL: ENFA0005-1915781.pdf; ComponentLink2Description: Order; ComponentLink2URL: https://hu.mouser.com/ProductDetail/Murata-Electronics/BLM21SP102SN1D?qs=17u8i%2FzlE88oj6hmj%252BXptA%3D%3D
R30#2 R?#23 = RESISTOR: Metal Film Resistor; Type: RES
U?#6 = PHA-13LN+: RF Amplifier, Low noise, 1M-1GHz, +5V, +23dB; Part number: 139-PHA-13LN; ComponentLink1Description: Datasheet; Supplier: Mouser; ComponentLink2Description: Order; ComponentLink2URL: https://hu.mouser.com/ProductDetail/Mini-Circuits/PHA-13LN%2b?qs=xZ%2FP%252Ba9zWqYkwnUBoTp7PQ%3D%3D; Type: IC

## Sheet OSCILLAR_HFB_V1p0_HFFILTB.SchDoc
size A4; SheetNumber: 7; SheetTotal: 12; Title_: High freq. Filter Bank
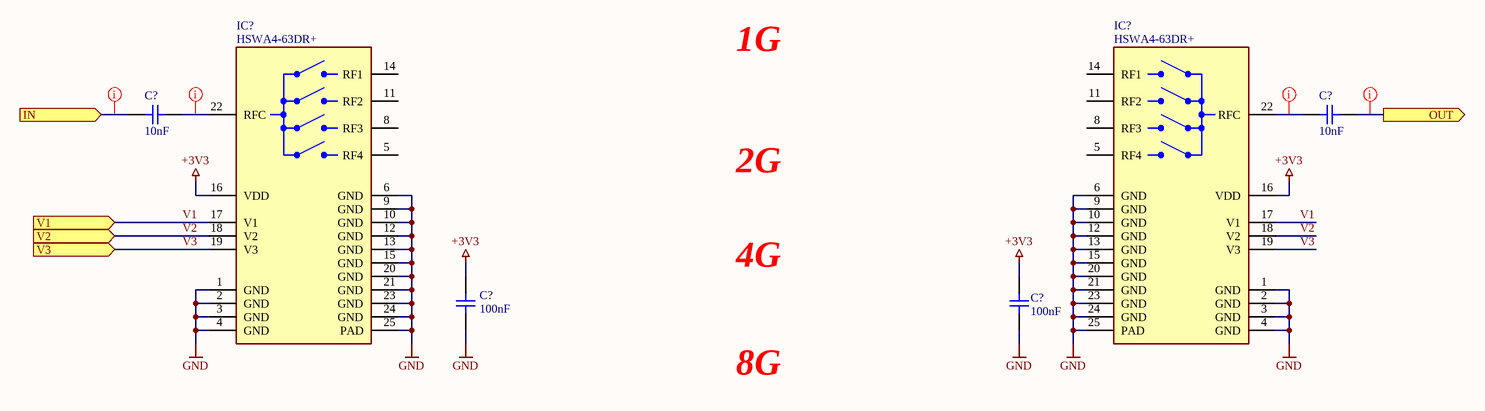
[diagram p9: OSCILLAR_HFB_V1p0_HFFILTB.SchDoc]

### Parts
(Parts that share a designator on the sheet are numbered #1, #2 ... from top to bottom, then left to right.)
C?#42  10nF  [CAP_0603]
C?#43  10nF  [CAP_0603]
C?#44  100nF  [CAP_0603]
C?#45  100nF  [CAP_0603]
IC?#5  HSWA4-63DR+  [DG984-1]
IC?#6  HSWA4-63DR+  [DG984-1]

### Ports
IN (in, see OSCILLAR_HFB_V1p0_MAIN), OUT (out, see OSCILLAR_HFB_V1p0_MAIN), V1 (in), V2 (in), V3 (in)

### Nets
+3V3: C?#44.2 C?#45.2 IC?#5.16(VDD) IC?#6.16(VDD)
GND: C?#44.1 C?#45.1 IC?#5.1(GND) IC?#5.2(GND) IC?#5.3(GND) IC?#5.4(GND) IC?#5.6(GND) IC?#5.9(GND) IC?#5.10(GND) IC?#5.12(GND) IC?#5.13(GND) IC?#5.15(GND) IC?#5.20(GND) IC?#5.21(GND) IC?#5.23(GND) IC?#5.24(GND) IC?#5.25(PAD) IC?#6.1(GND) IC?#6.2(GND) IC?#6.3(GND) IC?#6.4(GND) IC?#6.6(GND) IC?#6.9(GND) IC?#6.10(GND) IC?#6.12(GND) IC?#6.13(GND) IC?#6.15(GND) IC?#6.20(GND) IC?#6.21(GND) IC?#6.23(GND) IC?#6.24(GND) IC?#6.25(PAD)
V1: IC?#5.17(V1) IC?#6.17(V1) ; port V1
V2: IC?#5.18(V2) IC?#6.18(V2) ; port V2
V3: IC?#5.19(V3) IC?#6.19(V3) ; port V3
NetC55#1_1: C?#43.2 ; port OUT
NetC100#1_2: C?#42.2 ; port IN
NetC?#42_1: C?#42.1 IC?#5.22(RFC)
NetC?#43_1: C?#43.1 IC?#6.22(RFC)

Not connected (* = marked no-connect by the designer): IC?#5 5(RF4) 8(RF3) 11(RF2) 14(RF1); IC?#6 5(RF4) 8(RF3) 11(RF2) 14(RF1)

### Layout directives
net class 50R: NetC55#1_1, NetC100#1_2, NetC?#42_1, NetC?#43_1

### Notes on the sheet
- 1G
- 2G
- 4G
- 8G
- Board:
- Author:
- Title:
- Project:
- SVN:
- Version:
- Sheet:
- of
- Contact:
- Modified:
- Size:
- A4

### Library data of the parts
C?#42-C?#45 = NP-CAPACITOR: MLCC capacitor; Type: CAP
IC?#5 IC?#6 = HSWA4-63DR+: RF Switch, SP4T, 30M-6GHz; Part number: 139-HSWA4-63DR; Supplier: Mouser; Type: IC; ComponentLink1Description: Datasheet; ComponentLink2Description: Order; ComponentLink2URL: https://hu.mouser.com/ProductDetail/Mini-Circuits/HSWA4-63DR%2b?qs=xZ%2FP%252Ba9zWqYOhYanAihSnw%3D%3D

## Sheet OSCILLAR_HFB_V1p0_LFFILTB.SchDoc
size A4; SheetNumber: 8; SheetTotal: 12; Title_: Low freq. Filter Bank
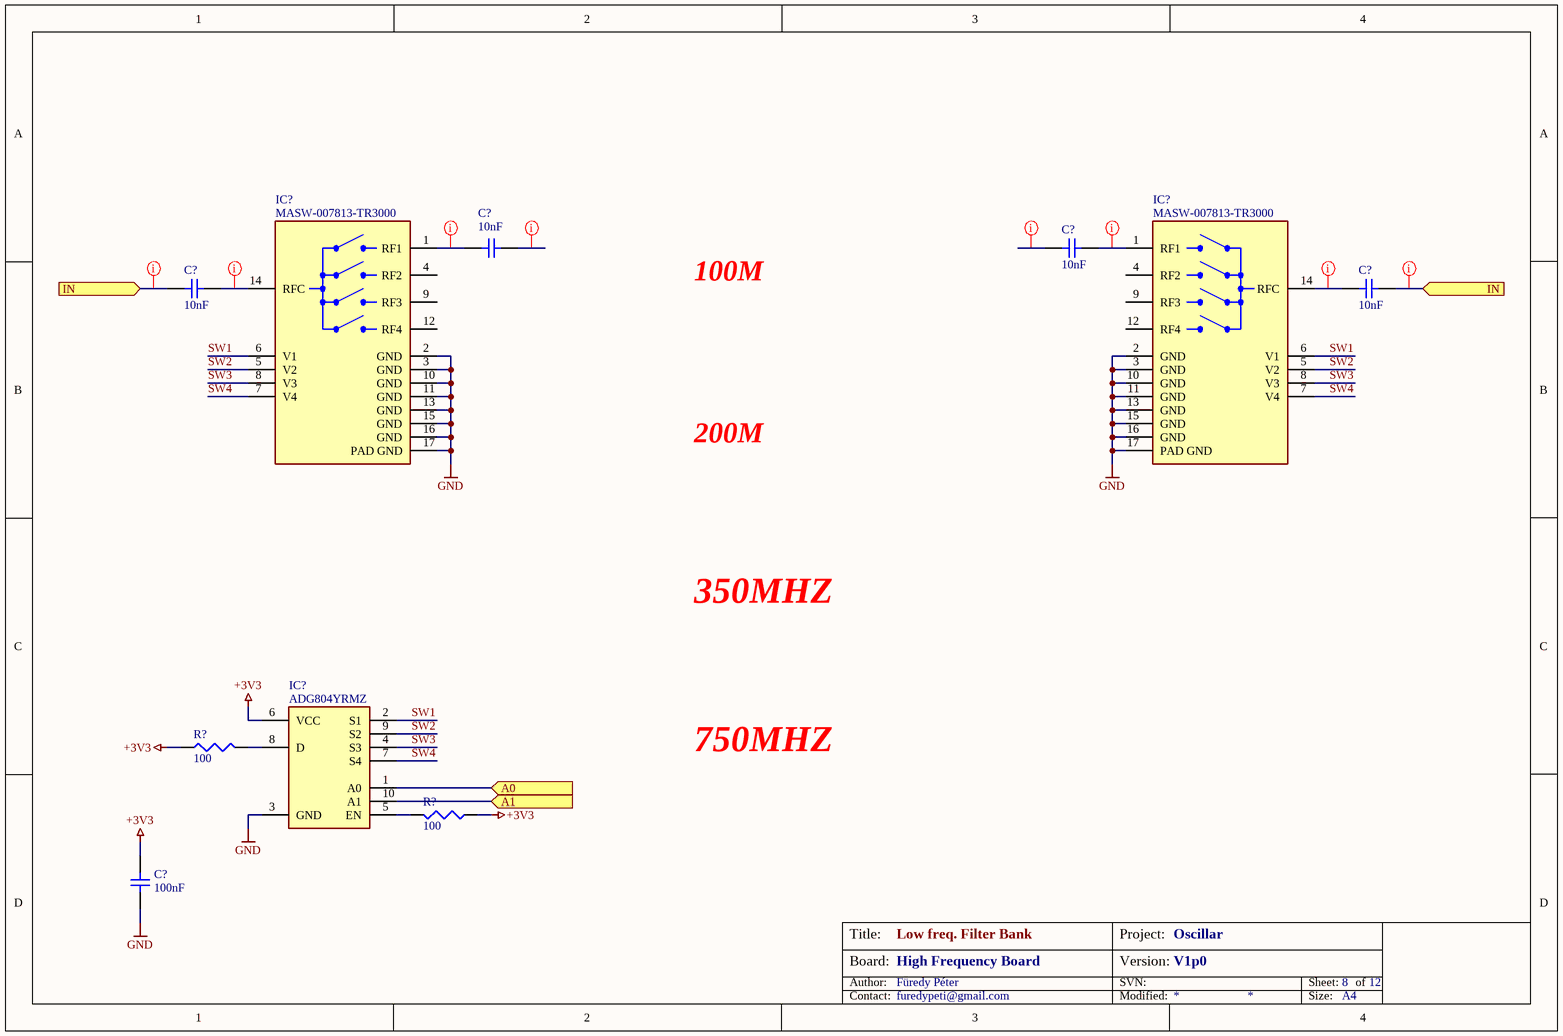
[diagram p10: OSCILLAR_HFB_V1p0_LFFILTB.SchDoc]

### Parts
(Parts that share a designator on the sheet are numbered #1, #2 ... from top to bottom, then left to right.)
C?#46  10nF  [CAP_0603]
C?#47  10nF  [CAP_0603]
C?#48  10nF  [CAP_0603]
C?#49  10nF  [CAP_0603]
C?#50  100nF  [CAP_0603]
IC?#7  MASW-007813-TR3000  [QFN-16]
IC?#8  MASW-007813-TR3000  [QFN-16]
IC?#9  ADG804YRMZ  [MSOP-10]
R?#24  100  [RES-0603]
R?#25  100  [RES-0603]

### Ports
A0 (in), A1 (in), IN (in, see OSCILLAR_HFB_V1p0_MAIN)

### Nets
+3V3: C?#50.2 IC?#9.6(VCC) R?#24.1 R?#25.1
GND: C?#50.1 IC?#7.2(GND) IC?#7.3(GND) IC?#7.10(GND) IC?#7.11(GND) IC?#7.13(GND) IC?#7.15(GND) IC?#7.16(GND) IC?#7.17(PAD_GND) IC?#8.2(GND) IC?#8.3(GND) IC?#8.10(GND) IC?#8.11(GND) IC?#8.13(GND) IC?#8.15(GND) IC?#8.16(GND) IC?#8.17(PAD_GND) IC?#9.3(GND)
SW1: IC?#7.6(V1) IC?#8.6(V1) IC?#9.2(S1)
SW2: IC?#7.5(V2) IC?#8.5(V2) IC?#9.9(S2)
SW3: IC?#7.8(V3) IC?#8.8(V3) IC?#9.4(S3)
SW4: IC?#7.7(V4) IC?#8.7(V4) IC?#9.7(S4)
NetC100#1_2: C?#48.2 C?#49.2 ; port IN
NetC?#46_2: C?#46.2 IC?#7.1(RF1)
NetC?#47_2: C?#47.2 IC?#8.1(RF1)
NetC?#48_1: C?#48.1 IC?#7.14(RFC)
NetC?#49_1: C?#49.1 IC?#8.14(RFC)
NetIC?#9_1: IC?#9.1(A0) ; port A0
NetIC?#9_5: IC?#9.5(EN) R?#25.2
NetIC?#9_8: IC?#9.8(D) R?#24.2
NetIC?#9_10: IC?#9.10(A1) ; port A1

Not connected (* = marked no-connect by the designer): C?#46 1; C?#47 1; IC?#7 4(RF2) 9(RF3) 12(RF4); IC?#8 4(RF2) 9(RF3) 12(RF4)

### Layout directives
net class 50R: NetC100#1_2, NetC?#46_1, NetC?#46_2, NetC?#47_1, NetC?#47_2, NetC?#48_1, NetC?#49_1

### Notes on the sheet
- 100M
- 200M
- 350MHZ
- 750MHZ
- Board:
- Author:
- Title:
- Project:
- SVN:
- Version:
- Sheet:
- of
- Contact:
- Modified:
- Size:
- A4

### Library data of the parts
C?#46-C?#50 = NP-CAPACITOR: MLCC capacitor; Type: CAP
IC?#7 IC?#8 = MASW-007813-TR3000: RF Switch, SP4T, DC-3GHz; Part number: 937-MASW007813TR3; Supplier: Mouser; Type: IC; ComponentLink1Description: Datasheet; ComponentLink2Description: Order; ComponentLink2URL: https://eu.mouser.com/ProductDetail/MACOM/MASW-007813-TR3000?qs=zQS7eqYV0KQlMvot4Elvtw%3D%3D
IC?#9 = ADG804YRMZ: Multiplexer Switch ICs 4-Channel,Low Voltage Multiplexer IC.; Part number: 584-ADG804YRMZ-R7; Type: IC; Supplier: Mouser; ComponentLink1Description: Datasheet; ComponentLink1URL: ADG804-1502993.pdf; ComponentLink2Description: Order; ComponentLink2URL: https://hu.mouser.com/ProductDetail/Analog-Devices/ADG804YRMZ-REEL7?qs=BpaRKvA4VqFEf8QtrI%2FU8w%3D%3D
R?#24 R?#25 = RESISTOR: Metal Film Resistor; Type: RES

## Sheet OSCILLAR_HFB_V1p0_DRV.SchDoc
size A4; SheetNumber: 13; SheetTotal: 13; Title_: Output Driver
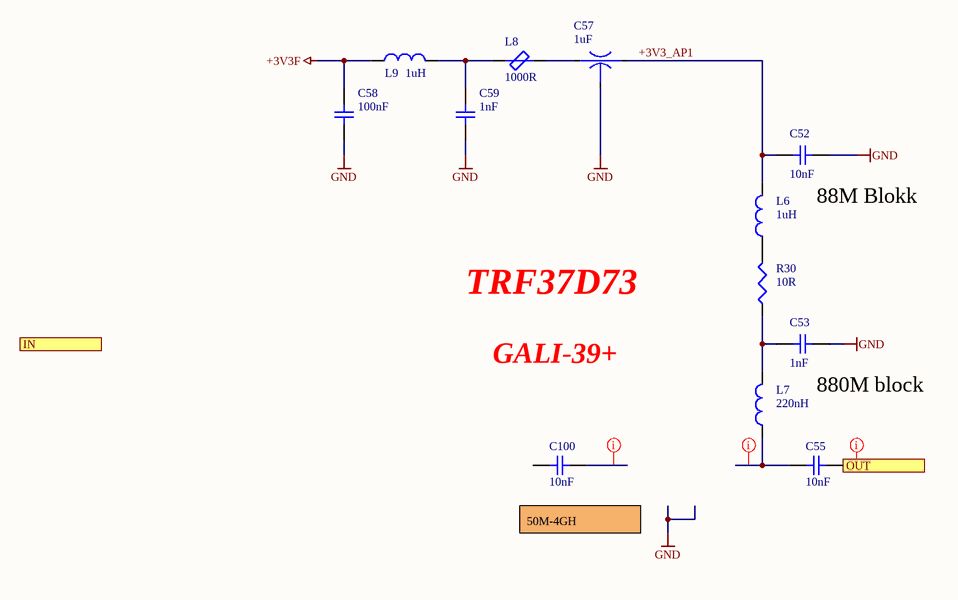
[diagram p11: OSCILLAR_HFB_V1p0_DRV.SchDoc]

### Parts
(Parts that share a designator on the sheet are numbered #1, #2 ... from top to bottom, then left to right.)
C52#2  10nF  [CAP-0805]
C53#3  1nF  [CAP-0805]
C55#3  10nF  [CAP_0603]
C57#3  1uF  [CAP-0805-EMI]
C58#3  100nF  [CAP-0805]
C59#3  1nF  [CAP-0805]
C100#3  10nF  [CAP_0603]
L6#2  1uH  [IND-0805]
L7#2  220nH  [IND-0805]
L8#3  1000R  [IND-0805-EMI]
L9#3  1uH  [IND-0805-EMI]
R30#3  10R  [RES-0805]

### Ports
IN (in, see OSCILLAR_HFB_V1p0_MAIN), OUT (out, see OSCILLAR_HFB_V1p0_MAIN)

### Nets
+3V3F: C58#3.1 L9#3.1
GND: C52#2.2 C53#3.2 C57#3.2 C58#3.2 C59#3.2
+3V3_AP1: C52#2.1 C57#3.1 L6#2.2
NetC53#3_1: C53#3.1 L7#2.2 R30#3.1
NetC55#1_1: C55#3.1 ; port OUT
NetC55#3_2: C55#3.2 L7#2.1
NetC57#3_3: C57#3.3 L8#3.2
NetC59#3_1: C59#3.1 L8#3.1 L9#3.2
NetL6#2_1: L6#2.1 R30#3.2

Not connected (* = marked no-connect by the designer): C100#3 1 2

### Layout directives
net class 50R: (no net found under the mark), NetC55#3_2, NetC100#3_1

### Notes on the sheet
- (near C52#2) 88M Blokk
- TRF37D73
- GALI-39+
- (near C53#3) 880M block
- (near C100#3) 50M-4GH
- Board:
- Author:
- Title:
- Project:
- SVN:
- Version:
- Sheet:
- of
- Contact:
- Modified:
- Size:
- A4

### Library data of the parts
C52#2 C53#3 C55#3 C58#3 C59#3 C100#3 = NP-CAPACITOR: MLCC capacitor; Type: CAP
C57#3 = EMI_CAPACITOR: EMI filter capacitor; Type: CAP
L6#2 L7#2 L9#3 = AC-INDUCTOR: Air core coil; Type: IND
L8#3 = BLM21SP102SN1D: as L?#1 on sheet OSCILLAR_HFB_V1p0_MSYN; Supplier: Mouser; ComponentLink1Description: Datasheet; ComponentLink1URL: ENFA0005-1915781.pdf; ComponentLink2Description: Order; ComponentLink2URL: https://hu.mouser.com/ProductDetail/Murata-Electronics/BLM21SP102SN1D?qs=17u8i%2FzlE88oj6hmj%252BXptA%3D%3D
R30#3 = RESISTOR: Metal Film Resistor; Type: RES

## Sheet OSCILLAR_HFB_V1p0_INT.SchDoc
size A4; SheetNumber: 3; SheetTotal: 15
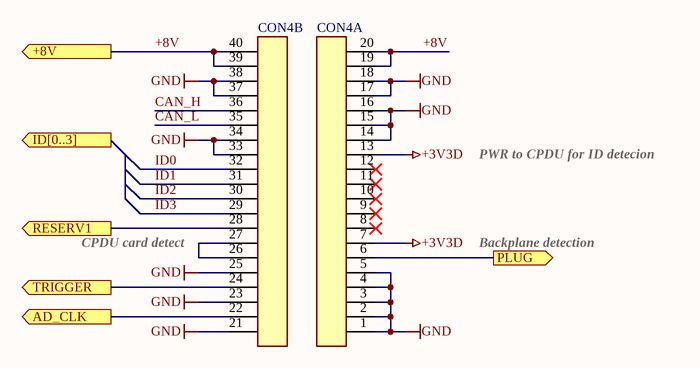
[diagram p12: OSCILLAR_HFB_V1p0_INT.SchDoc]

### Parts
CON4  CON2x20  [CON40_SIMPLE_TH_2x20]  (value not drawn)  (parts A,B of 2)

### Ports
+8V (out, see OSCILLAR_HFB_V1p0_MAIN[1B]), AD_CLK (out, see OSCILLAR_HFB_V1p0_MAIN[1B]), ID[0..3] (out, see OSCILLAR_HFB_V1p0_MAIN[1B]), PLUG (out, see OSCILLAR_HFB_V1p0_MAIN[1B]), RESERV1 (out, see OSCILLAR_HFB_V1p0_MAIN[1B]), TRIGGER (out, see OSCILLAR_HFB_V1p0_MAIN[1B])

### Nets
+3V3D: CON4.7 CON4.13
GND: CON4.1 CON4.2 CON4.3 CON4.4 CON4.5 CON4.14 CON4.15 CON4.16 CON4.17 CON4.18 CON4.21 CON4.23 CON4.25 CON4.33 CON4.34 CON4.37 CON4.38
+8V: CON4.19 CON4.20 CON4.39 CON4.40 ; port +8V
CAN_H: CON4.36
CAN_L: CON4.35
ID0: CON4.32
ID1: CON4.31
ID2: CON4.30
ID3: CON4.29
NetCON4_6: CON4.6 ; port PLUG
NetCON4_22: CON4.22 ; port AD_CLK
NetCON4_24: CON4.24 ; port TRIGGER
NetCON4_26: CON4.26 CON4.27
NetCON4_28: CON4.28 ; port RESERV1

Not connected (* = marked no-connect by the designer): CON4 8* 9* 10* 11* 12*

### Notes on the sheet
- PWR to CPDU for ID detecion
- CPDU card detect
- Backplane detection
- Board:
- Author:
- Title:
- Project:
- SVN:
- Version:
- Sheet:
- of
- Contact:
- Modified:
- Size:
- A4

### Library data of the parts
CON4 = CON2x20: Simple 2x20pin THT, 2.54mm; Type: CON

## Nets that join several sheets
+3V3: OSCILLAR_HFB_V1p0_MSYN (C?#10.1 C?#14.2 L?#6.1 U?#2.7), OSCILLAR_HFB_V1p0_CAL (C?#31.1 U?#4.2 U?#4.3), MAIN/HFPS (C?_MAIN_HFPS#1.2 IC?_MAIN_HFPS#3.5), MAIN/HFPS (C?_MAIN_HFPS#2.2 IC?_MAIN_HFPS#6.5), OSCILLAR_HFB_V1p0_LFLNAMP (C58#2.1 L9#2.1), OSCILLAR_HFB_V1p0_HFFILTB (C?#44.2 C?#45.2 IC?#5.16 IC?#6.16), OSCILLAR_HFB_V1p0_LFFILTB (C?#50.2 IC?#9.6 R?#24.1 R?#25.1)
+3V3F: OSCILLAR_HFB_V1p0_MSYN (8 pins), OSCILLAR_HFB_V1p0_DRV (C58#3.1 L9#3.1)
+5V: OSCILLAR_HFB_V1p0_CAL (7 pins), OSCILLAR_HFB_V1p0_LVL (IC?#4.14), OSCILLAR_HFB_V1p0_HFLNAMP (C58#1.1 L9#1.1)
GND: OSCILLAR_HFB_V1p0_MAIN (CON?#1.2 CON?#1.3 CON?#1.4 CON?#1.5), OSCILLAR_HFB_V1p0_MSYN (44 pins), OSCILLAR_HFB_V1p0_CAL (15 pins), OSCILLAR_HFB_V1p0_LVL (8 pins), OSCILLAR_HFB_V1p0_MECH (12 pins), MAIN/HFPS (C?_MAIN_HFPS#1.1 IC?_MAIN_HFPS#2.5 IC?_MAIN_HFPS#2.7 IC?_MAIN_HFPS#3.3), MAIN/HFPS (C?_MAIN_HFPS#2.1 IC?_MAIN_HFPS#5.5 IC?_MAIN_HFPS#5.7 IC?_MAIN_HFPS#6.3), OSCILLAR_HFB_V1p0_HFLNAMP (13 pins), OSCILLAR_HFB_V1p0_LFLNAMP (7 pins), OSCILLAR_HFB_V1p0_HFFILTB (32 pins), OSCILLAR_HFB_V1p0_LFFILTB (18 pins), OSCILLAR_HFB_V1p0_DRV (5 pins), OSCILLAR_HFB_V1p0_INT (17 pins)
CTRL: MAIN/HFPS (IC?_MAIN_HFPS#1.2 IC?_MAIN_HFPS#2.1), MAIN/HFPS (IC?_MAIN_HFPS#4.2 IC?_MAIN_HFPS#5.1)
NetC55#1_1: OSCILLAR_HFB_V1p0_CAL (C56#1.1), OSCILLAR_HFB_V1p0_HFLNAMP (C55#1.1), OSCILLAR_HFB_V1p0_LFLNAMP (C55#2.1), OSCILLAR_HFB_V1p0_HFFILTB (C?#43.2), OSCILLAR_HFB_V1p0_DRV (C55#3.1)
NetC100#1_2: OSCILLAR_HFB_V1p0_CAL (C?#28.2), OSCILLAR_HFB_V1p0_LVL (C?#38.2), OSCILLAR_HFB_V1p0_HFLNAMP (C100#1.2), OSCILLAR_HFB_V1p0_LFLNAMP (C100#2.2), OSCILLAR_HFB_V1p0_HFFILTB (C?#42.2), OSCILLAR_HFB_V1p0_LFFILTB (C?#48.2 C?#49.2)
NetIC?_MAIN_HFPS#2_2: MAIN/HFPS (IC?_MAIN_HFPS#2.2), MAIN/HFPS (IC?_MAIN_HFPS#5.2)
NetIC?_MAIN_HFPS#2_4: MAIN/HFPS (IC?_MAIN_HFPS#2.4), MAIN/HFPS (IC?_MAIN_HFPS#5.4)
NetIC?_MAIN_HFPS#2_6: MAIN/HFPS (IC?_MAIN_HFPS#2.6), MAIN/HFPS (IC?_MAIN_HFPS#5.6)
SDI: OSCILLAR_HFB_V1p0_MSYN (U?#2.17), OSCILLAR_HFB_V1p0_CAL (U?#4.8)
V1: OSCILLAR_HFB_V1p0_LVL (IC?#4.1), OSCILLAR_HFB_V1p0_HFFILTB (IC?#5.17 IC?#6.17)